# EAGLE schematic TSMPC (EAGLE 9.3.0)
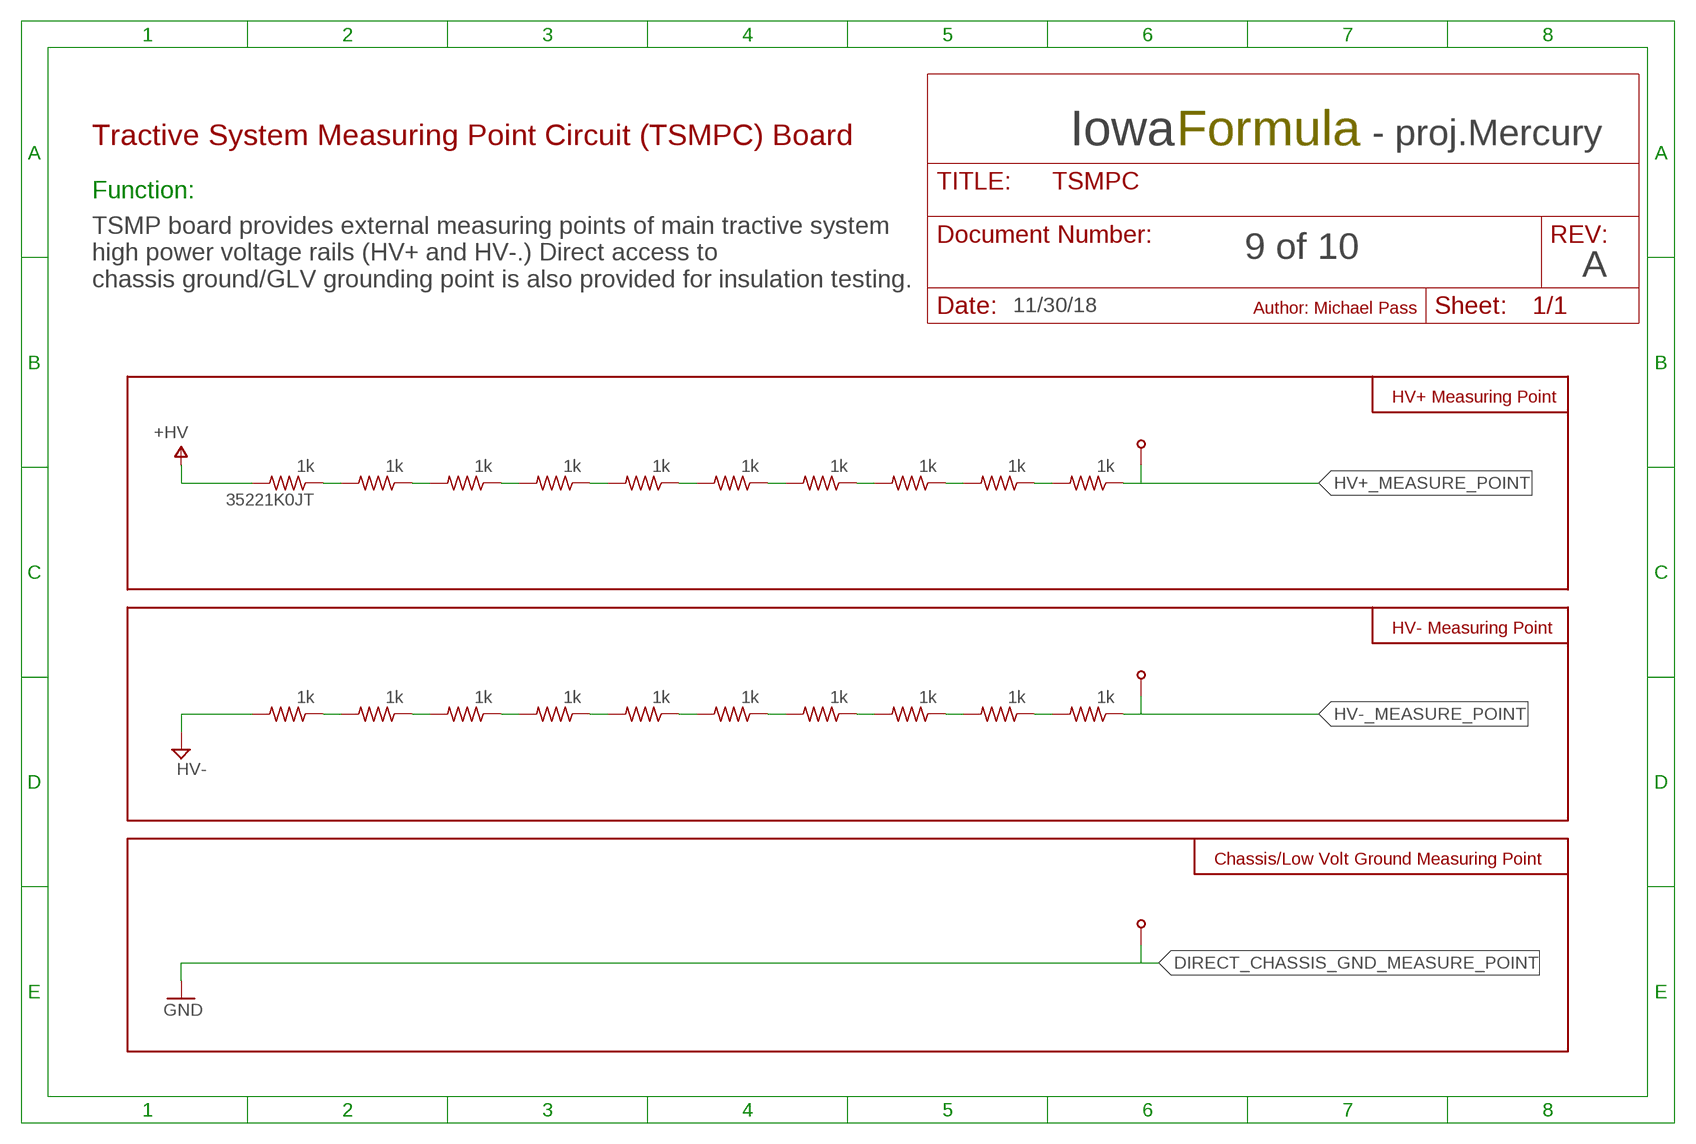
[diagram p0: schematic, sheet 1]

## Parts
35221K0JT  1k  R-US_R0805  [R0805]
R2  1k  R-US_R0805  [R0805]
R3  1k  R-US_R0805  [R0805]
R4  1k  R-US_R0805  [R0805]
R5  1k  R-US_R0805  [R0805]
R6  1k  R-US_R0805  [R0805]
R7  1k  R-US_R0805  [R0805]
R8  1k  R-US_R0805  [R0805]
R9  1k  R-US_R0805  [R0805]
R10  1k  R-US_R0805  [R0805]
R21  1k  R-US_R0805  [R0805]
R22  1k  R-US_R0805  [R0805]
R23  1k  R-US_R0805  [R0805]
R24  1k  R-US_R0805  [R0805]
R25  1k  R-US_R0805  [R0805]
R26  1k  R-US_R0805  [R0805]
R27  1k  R-US_R0805  [R0805]
R28  1k  R-US_R0805  [R0805]
R29  1k  R-US_R0805  [R0805]
R30  1k  R-US_R0805  [R0805]
U$1  BANANA-JACK  [BANANA-PRINT]
U$3  BANANA-JACK  [BANANA-PRINT]
U$4  BANANA-JACK  [BANANA-PRINT]

## Nets
DIRECT_CHASSIS_GND_MEASURE_POINT: R21.2 U$3.P$1(PIN) ; supply symbol labelled GND, HV-
HV+_MEASURE_POINT: R10.1 U$1.P$1(PIN)
HV-_MEASURE_POINT: R30.1 U$4.P$1(PIN)
N$1: 35221K0JT.1 R2.2
N$2: R2.1 R3.2
N$3: R3.1 R4.2
N$4: R4.1 R5.2
N$5: R5.1 R6.2
N$6: R6.1 R7.2
N$7: R7.1 R8.2
N$8: R8.1 R9.2
N$9: R9.1 R10.2
N$21: R21.1 R22.2
N$22: R22.1 R23.2
N$23: R23.1 R24.2
N$24: R24.1 R25.2
N$25: R25.1 R26.2
N$26: R26.1 R27.2
N$27: R27.1 R28.2
N$28: R28.1 R29.2
N$29: R29.1 R30.2
V+: 35221K0JT.2 ; supply symbol labelled +HV

## Notes on the sheet
- Tractive System Measuring Point Circuit (TSMPC) Board | Iowa | Formula | - proj.Mercury
- Function:
- 9 of 10
- A
- TSMP board provides external measuring points of main tractive system
  high power voltage rails (HV+ and HV-.) Direct access to
  chassis ground/GLV grounding point is also provided for insulation testing.
- 11/30/18 | Author: Michael Pass
- HV+ Measuring Point
- HV- Measuring Point
- Chassis/Low Volt Ground Measuring Point

## Library data of the parts
35221K0JT R2-R10 R21-R30 = rcl:R-US_: RESISTOR, American symbol; SPICEPREFIX: R
U$1 U$3 U$4 = con-banana:BANANA-JACK